# Altium schematic sheet AnalogConnector.SchDoc
size A4; CompanyName: Technische Hochschule Nürnberg Georg Simon Ohm; Organization: UltraZohm; Address1: Kesslerplatz 12; Address2: 90489 Nürnberg; Address3: GERMANY; DocumentNumber: 4; SheetNumber: 4; SheetTotal: 12; Website: www.ultrazohm.com
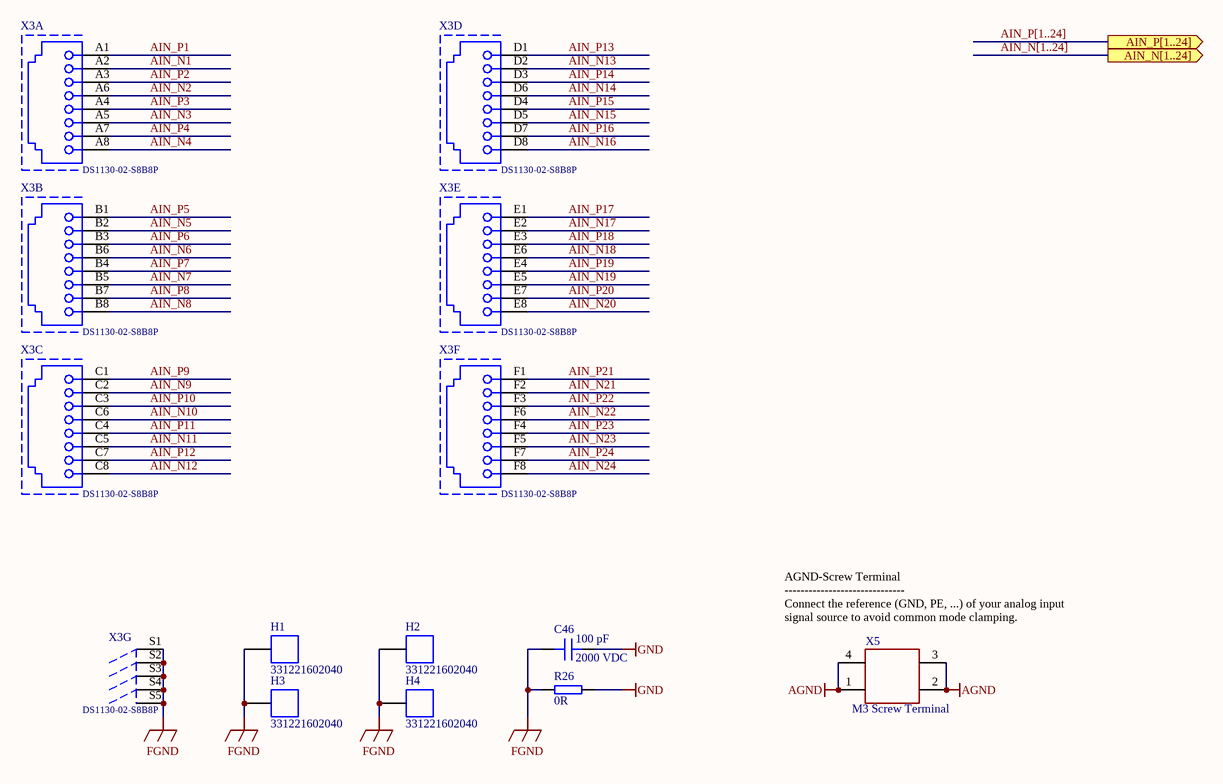
[diagram p0: AnalogConnector.SchDoc]

## Parts
C46  100 pF  Voltage Rating: 2000 VDC  [C_1206]
H1  331221602040  [331221602040]
H2  331221602040  [331221602040]
H3  331221602040  [331221602040]
H4  331221602040  [331221602040]
R26  0R  [R_1206_TE]
X3  DS1130-02-S8B8P  [DS1130-02-S8B8P]  (parts A,B,C,D,E,F,G of 7)
X5  M3 Screw Terminal  [KEYSTONE_7698]

## Ports
AIN_N[1..24] (out), AIN_P[1..24] (out)

## Nets
AGND: X5.1 X5.2 X5.3 X5.4
FGND: C46.1 H1.1 H2.1 H3.1 H4.1 R26.1 X3.S1 X3.S2 X3.S3 X3.S4 X3.S5
GND: C46.2 R26.2
AIN_N1: X3.A2
AIN_N2: X3.A6
AIN_N3: X3.A5
AIN_N4: X3.A8
AIN_N5: X3.B2
AIN_N6: X3.B6
AIN_N7: X3.B5
AIN_N8: X3.B8
AIN_N9: X3.C2
AIN_N10: X3.C6
AIN_N11: X3.C5
AIN_N12: X3.C8
AIN_N13: X3.D2
AIN_N14: X3.D6
AIN_N15: X3.D5
AIN_N16: X3.D8
AIN_N17: X3.E2
AIN_N18: X3.E6
AIN_N19: X3.E5
AIN_N20: X3.E8
AIN_N21: X3.F2
AIN_N22: X3.F6
AIN_N23: X3.F5
AIN_N24: X3.F8
AIN_P1: X3.A1
AIN_P2: X3.A3
AIN_P3: X3.A4
AIN_P4: X3.A7
AIN_P5: X3.B1
AIN_P6: X3.B3
AIN_P7: X3.B4
AIN_P8: X3.B7
AIN_P9: X3.C1
AIN_P10: X3.C3
AIN_P11: X3.C4
AIN_P12: X3.C7
AIN_P13: X3.D1
AIN_P14: X3.D3
AIN_P15: X3.D4
AIN_P16: X3.D7
AIN_P17: X3.E1
AIN_P18: X3.E3
AIN_P19: X3.E4
AIN_P20: X3.E7
AIN_P21: X3.F1
AIN_P22: X3.F3
AIN_P23: X3.F4
AIN_P24: X3.F7

## Buses and harness runs
bus AIN_N[1..24] = port AIN_N[1..24]
bus AIN_P[1..24] = port AIN_P[1..24]

## Notes on the sheet
- (near X5) AGND-Screw Terminal
  ------------------------------
  Connect the reference (GND, PE, ...) of your analog input signal source to avoid common mode clamping.
- Title
- Revision:
- Design Engineer:
- Date:
- Project:
- Sheet
- of

## Library data of the parts
C46 = CC1206JKNPODBN101: 2kV 100pF NP0 ±5% 1206 Multilayer Ceramic Capacitors MLCC - SMD/SMT ROHS; Manufacturer: YAGEO; Created from: AGeiger; Manufacturer Part Number: CC1206JKNPODBN101; PartID: 115; Created On: 02.12.2022 11:59:53; ComponentLink1Description: Datasheet; ComponentLink1URL: https://datasheet.lcsc.com/lcsc/2108131530_YAGEO-CC1206JKNPODBN101_C113876.pdf; Component Type: Capacitor 1206; Device Package: 1206; Last Updated: 02.12.2022 11:59:53; Mounting Type: SMD; Operating Temperature: -55 to +125°C; Series: NP0; Supplier 1: LCSC; Supplier Part Number 1: C113876; Type: Capacitor; Tolerance: 5 %; Value: 100 pF; Live Cycle Status: 1; LCSC Part Number: C113876
H1-H4 = 331221602040: Contact Finger between PCB's earth and housing; Manufacturer: Wuerth Elektronik; Match Code: WE-SECF; Recommended Working Height Min: 5mm; Recommended Working Height Max: 5.7mm; Created from: AGeiger; ComponentLink1Description: Datasheet; ComponentLink1URL: https://redexpert.we-online.com/redexpert/spec/331221602040.pdf; ComponentLink2Description: Datasheet Link; ComponentLink2URL: https://www.we-online.com/redexpert/spec/331221602040?ad; Manufacturer Part Number: 331221602040; Category: EMC Shielding; Mount: Surface Mount; Operating Temperature Max: 100°C; Operating Temperature Min: -40°C; Packaging: Tape and Reel; Length: 6mm; Width: 2mm; Height: 4mm; Material: Copper Beryllium (CuBe) gold-plated(AU); PartID: 18; Created On: 02.12.2022 10:27:54; Component Type: EMI Contact Finger; Last Updated: 02.12.2022 10:27:54; Mounting Type: SMD; Operating Temperature: -40 to +100 °C; Series: SECF; Supplier 1: Mouser; Supplier Part Number 1: 710-331221602040; Type: Contact Finger; Value: 331221602040; Live Cycle Status: 1
R26 = UZgen_R_1206_0R: Generic resistor; Manufacturer: UZgen; Tolerance: 1 %; Created from: UZgenTool; Manufacturer Part Number: UZgen_R_1206_0R; PartID: 583; Created On: 08.07.2024 14:34:30; Device Package: 1206; Last Updated: 08.07.2024 14:34:30; Mounting Type: SMD; Value: 0R
X3 = DS1130-02-S8B8P: RJ45 RJReceptacle 6 No Plugin Ethernet Connectors/Modular Connectors (RJ45 RJ11) ROHS; Manufacturer: CONNFLY Elec; Created from: AGeiger; Manufacturer Part Number: DS1130-02-S8B8P; PartID: 7; Created On: 20.09.2022 09:18:12; ComponentLink1Description: Datasheet; ComponentLink1URL: https://datasheet.lcsc.com/lcsc/1811141116_CONNFLY-Elec-DS1130-02-S8B8P_C86584.pdf; Component Type: RJ45 Connector; Device Package: RJ45; Last Updated: 20.09.2022 09:18:12; Mounting Type: THT; Supplier 1: LCSC; Supplier Part Number 1: C86584; Type: RJ45 Connector; Live Cycle Status: 1; LCSC Part Number: C86584; Stock number: not stored
X5 = Keystone: Tin 15A Brass 4 Through Hole M3x0.5 Screw Connectors ROHS; Created from: AGeiger; Manufacturer Part Number: Keystone; PartID: 5; Created On: 02.10.2025 12:53:47; ComponentLink1Description: Datasheet; ComponentLink1URL: https://www.mouser.de/datasheet/3/201/1/7698.PDF; Component Type: Metric Screw Terminal; Last Updated: 02.10.2025 13:02:36; Mounting Type: THT; Supplier 1: Mouser; Supplier Part Number 1: 534-7698; Supplier 2: LCSC; Supplier Part Number 2: C6708741; Value: M3 Screw Terminal; LCSC Part Number: C6708741